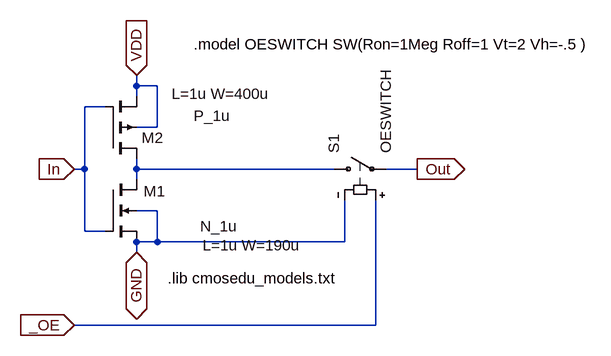
[diagram p0: schematic 74act240sim_oe.asc]
74act240sim_oe.asc, the LTspice schematic file:
Version 4
SHEET 1 1280 680
WIRE 448 -32 448 -48
WIRE 480 -32 448 -32
WIRE 448 -16 448 -32
WIRE 400 0 368 0
WIRE 480 32 480 -32
WIRE 480 32 448 32
WIRE 368 96 368 0
WIRE 368 96 352 96
WIRE 448 96 448 80
WIRE 752 96 448 96
WIRE 880 96 832 96
WIRE 448 112 448 96
WIRE 480 160 448 160
WIRE 368 192 368 96
WIRE 400 192 368 192
WIRE 480 208 480 160
WIRE 480 208 448 208
WIRE 768 208 768 144
WIRE 768 208 480 208
WIRE 448 224 448 208
WIRE 816 336 816 144
WIRE 816 336 352 336
FLAG 448 -48 VDD
IOPIN 448 -48 In
FLAG 352 96 In
IOPIN 352 96 In
FLAG 880 96 Out
IOPIN 880 96 Out
FLAG 448 224 GND
IOPIN 448 224 BiDir
FLAG 352 336 _OE
IOPIN 352 336 In
SYMBOL nmos4 400 112 R0
WINDOW 0 59 18 Left 2
WINDOW 3 146 72 Left 2
WINDOW 123 150 101 Left 2
SYMATTR InstName M1
SYMATTR Value N_1u
SYMATTR Value2 L=1u W=190u
SYMBOL pmos4 400 80 M180
WINDOW 123 102 100 Left 2
WINDOW 3 136 66 Left 2
SYMATTR Value2 L=1u W=400u
SYMATTR Value P_1u
SYMATTR InstName M2
SYMBOL sw 736 96 R270
SYMATTR InstName S1
SYMATTR Value OESWITCH
TEXT 496 264 Left 2 !.lib cmosedu_models.txt
TEXT 536 -96 Left 2 !.model OESWITCH SW(Ron=1Meg Roff=1 Vt=2 Vh=-.5 )

The netlist it stands for:
* 74act240sim_oe.asc
M1 N001 In GND GND N_1u L=1u W=190u
M2 N001 In VDD VDD P_1u L=1u W=400u
S1 N001 Out _OE GND OESWITCH
.model NMOS NMOS
.model PMOS PMOS
.lib standard.mos
.lib cmosedu_models.txt
.model OESWITCH SW(Ron=1Meg Roff=1 Vt=2 Vh=-.5 )
.backanno
.end